# EAGLE design PrimalLogger_Feather (EAGLE 9.5.2)
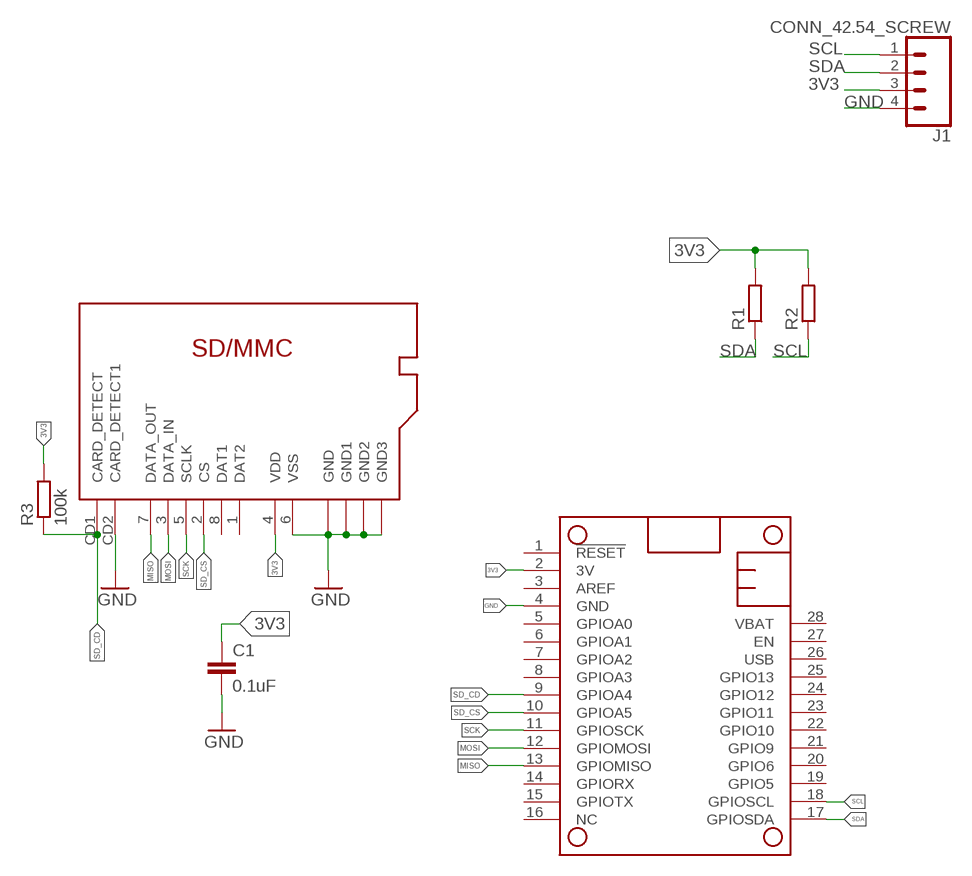
[diagram p0: schematic, sheet 1]

## Parts
C1  0.1uF  C-EU0.1UFC0603  [C0603]
J1  CONN_42.54_SCREW  [1X04_SCREW]
MS1  FEATHERWING_NODIM  [FEATHERWING_DIM]
R1  R-EU_10KR0603  [R0603]
R2  R-EU_10KR0603  [R0603]
R3  100k  R-EU_100KR0603  [R0603]
SD1  MICRO_SD  [CUSTOM-PARTS_SD_MICRO]

## Nets
3V3: C1.1 J1.3 MS1.2(3V) R1.2 R2.2 R3.2 SD1.4(VDD)
GND: C1.2 J1.4 MS1.4(GND) SD1.6(VSS) SD1.CD2(CARD_DETECT1) SD1.GND@1(GND) SD1.GND@2(GND1) SD1.GND@3(GND2) SD1.GND@5(GND3)
MISO: MS1.13(GPIOMISO) SD1.7(DATA_OUT)
MOSI: MS1.12(GPIOMOSI) SD1.3(DATA_IN)
SCK: MS1.11(GPIOSCK) SD1.5(SCLK)
SCL: J1.1 MS1.18(GPIOSCL) R2.1
SD_CD: MS1.9(GPIOA4) R3.1 SD1.CD1(CARD_DETECT)
SD_CS: MS1.10(GPIOA5) SD1.2(CS)
SDA: J1.2 MS1.17(GPIOSDA) R1.1
Unconnected: MS1.1(!RESET) MS1.3(AREF) MS1.5(GPIOA0) MS1.6(GPIOA1) MS1.7(GPIOA2) MS1.8(GPIOA3) MS1.14(GPIORX) MS1.15(GPIOTX) MS1.16(NC) MS1.19(GPIO5) MS1.20(GPIO6) MS1.21(GPIO9) MS1.22(GPIO10) MS1.23(GPIO11) MS1.24(GPIO12) MS1.25(GPIO13) MS1.26(USB) MS1.27(EN) MS1.28(VBAT) SD1.1(DAT2) SD1.8(DAT1)

## Library data of the parts
C1 = bschulz_passives:C-EU: CAPACITOR, European symbol; DIGIKEY: 490-6051-1-ND; MF: Murata; MPN: GCM188R71E104KA57D
J1 = bschulz:CONN_4: Genaric 4 terminal header Digikey 2.54_SCREW <https://www.digikey.com/product-detail/en/on-shore-technology-inc/OSTVN04A150/ED10563-ND/1588864>; DIGIKEY: ED10563-ND; MF: On Shore; MPN: OSTVN04A150
MS1 = bschulz:FEATHERWING
R1 R2 = bschulz_passives:R-EU_: RESISTOR, European symbol Digikey Parts: Yageo, 0402 <https://www.digikey.com/products/en/resistors/chip-resistor-surface-mount/52?k=&pkeyword=&sv=0&s=4356&sf=1&FV=-1%7C13%2C7%7C2%2C1291%7C39157%2C1989%7C0%2C-8%7C52%2C3%7C1131%2C3%7C2503&quantity=&ColumnSort=0&page=1&stock=1&pageSize=25> Yageo, 0603 <https://www.digikey.com/products/en/resistors/chip-resistor-surface-mount/52?k=&pkeyword=&sv=0&pv1291=39245&sf=1&FV=-5%7C4356%2C-5%7C47360%2C-8%7C52%2C-1%7C13%2C7%7C2%2C1989%7C0&quantity=10&ColumnSort=1000011&page=1&stock=1&pageSize=25> Panasonic, 0603 <https://www.digikey.com/products/en/resistors/chip-resistor-surface-mount/52?k=&pkeyword=&pv252=68&sf=0&FV=ffec373d%2C1c0002%2C142c040c%2C1f140000%2Cffe00034%2C80002%2Cc0001&quantity=&ColumnSort=0&page=1&stock=1&pageSize=25> Panasonic, precision, 0603 <https://www.digikey.com/products/en/resistors/chip-resistor-surface-mount/52?FV=ffec4907%2Cfffc000a%2Cc0172%2C142c040c%2C1f140000%2Cffe00034%2C1c0002&quantity=100&ColumnSort=2085&page=1&stock=1&pageSize=25> Panasonic, 0805 <https://www.digikey.com/products/en/resistors/chip-resistor-surface-mount/52?k=&pkeyword=&pv3=1&sf=0&FV=ffec373d%2C1c0002%2C1f140000%2Cffe00034%2C142c040d&quantity=&ColumnSort=0&page=1&stock=1&pageSize=25> Rohm, current sense <https://www.digikey.com/products/en/resistors/chip-resistor-surface-mount/52?k=&pkeyword=&pv3=1&sf=0&FV=ffecb688%2C1f140000%2Cffe00034%2C1c0002&quantity=&ColumnSort=0&page=1&stock=1&pageSize=25> Vishay, pulse proof automotive <https://www.digikey.com/products/en/resistors/chip-resistor-surface-mount/52?k=&pkeyword=&pv7=2&sf=0&FV=ffec5d6b%2Cffe00034%2C1f140000&quantity=&ColumnSort=0&page=1&stock=1&pageSize=25>; DIGIKEY: 311-10.0KHRCT-ND; MF: Yageo; MPN: RC0603FR-0710KL; VALUE_PART: 10k
R3 = bschulz_passives:R-EU_: RESISTOR, European symbol Digikey Parts: Yageo, 0402 <https://www.digikey.com/products/en/resistors/chip-resistor-surface-mount/52?k=&pkeyword=&sv=0&s=4356&sf=1&FV=-1%7C13%2C7%7C2%2C1291%7C39157%2C1989%7C0%2C-8%7C52%2C3%7C1131%2C3%7C2503&quantity=&ColumnSort=0&page=1&stock=1&pageSize=25> Yageo, 0603 <https://www.digikey.com/products/en/resistors/chip-resistor-surface-mount/52?k=&pkeyword=&sv=0&pv1291=39245&sf=1&FV=-5%7C4356%2C-5%7C47360%2C-8%7C52%2C-1%7C13%2C7%7C2%2C1989%7C0&quantity=10&ColumnSort=1000011&page=1&stock=1&pageSize=25> Panasonic, 0603 <https://www.digikey.com/products/en/resistors/chip-resistor-surface-mount/52?k=&pkeyword=&pv252=68&sf=0&FV=ffec373d%2C1c0002%2C142c040c%2C1f140000%2Cffe00034%2C80002%2Cc0001&quantity=&ColumnSort=0&page=1&stock=1&pageSize=25> Panasonic, precision, 0603 <https://www.digikey.com/products/en/resistors/chip-resistor-surface-mount/52?FV=ffec4907%2Cfffc000a%2Cc0172%2C142c040c%2C1f140000%2Cffe00034%2C1c0002&quantity=100&ColumnSort=2085&page=1&stock=1&pageSize=25> Panasonic, 0805 <https://www.digikey.com/products/en/resistors/chip-resistor-surface-mount/52?k=&pkeyword=&pv3=1&sf=0&FV=ffec373d%2C1c0002%2C1f140000%2Cffe00034%2C142c040d&quantity=&ColumnSort=0&page=1&stock=1&pageSize=25> Rohm, current sense <https://www.digikey.com/products/en/resistors/chip-resistor-surface-mount/52?k=&pkeyword=&pv3=1&sf=0&FV=ffecb688%2C1f140000%2Cffe00034%2C1c0002&quantity=&ColumnSort=0&page=1&stock=1&pageSize=25> Vishay, pulse proof automotive <https://www.digikey.com/products/en/resistors/chip-resistor-surface-mount/52?k=&pkeyword=&pv7=2&sf=0&FV=ffec5d6b%2Cffe00034%2C1f140000&quantity=&ColumnSort=0&page=1&stock=1&pageSize=25>; DIGIKEY: 311-100KHRCT-ND; MF: Yageo; MPN: RC0603FR-07100KL; VALUE_PART: 100k
SD1 = bschulz:MICRO_SD: Micro SD card holder, Push-Pull, Exposed leads for easy (non-reflow) soldering PN: HR1941CT-ND

## Board
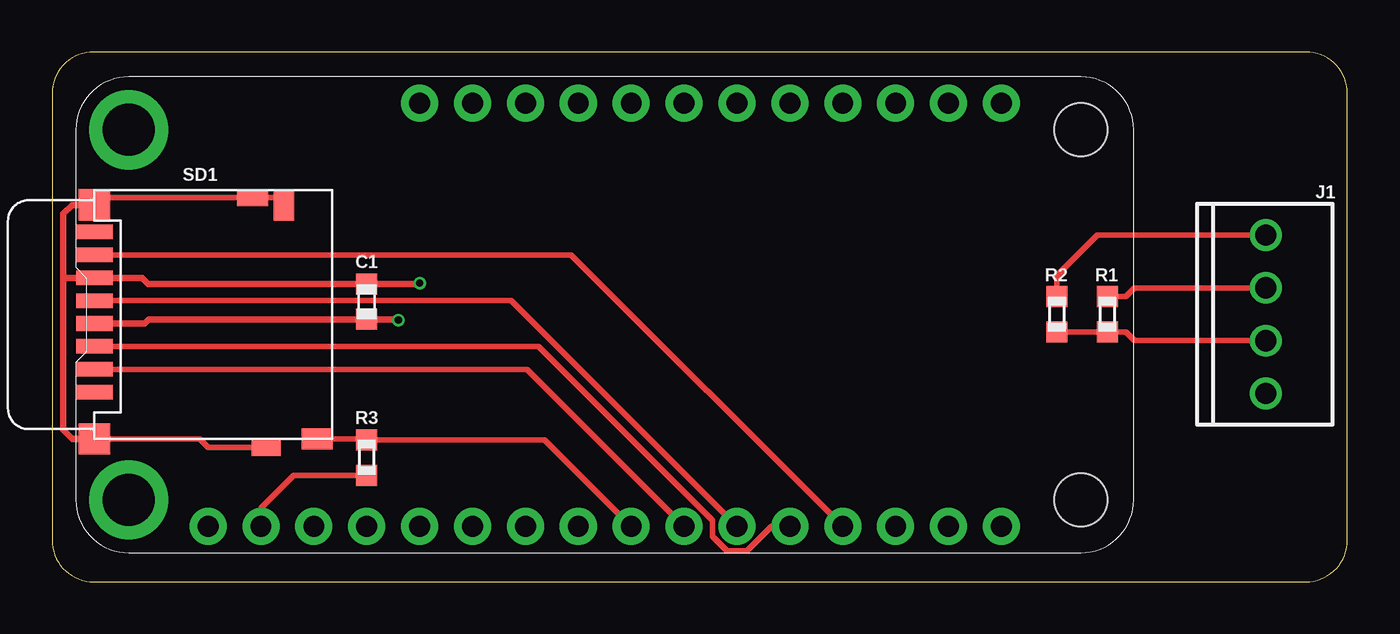
[diagram p1: board, top side]
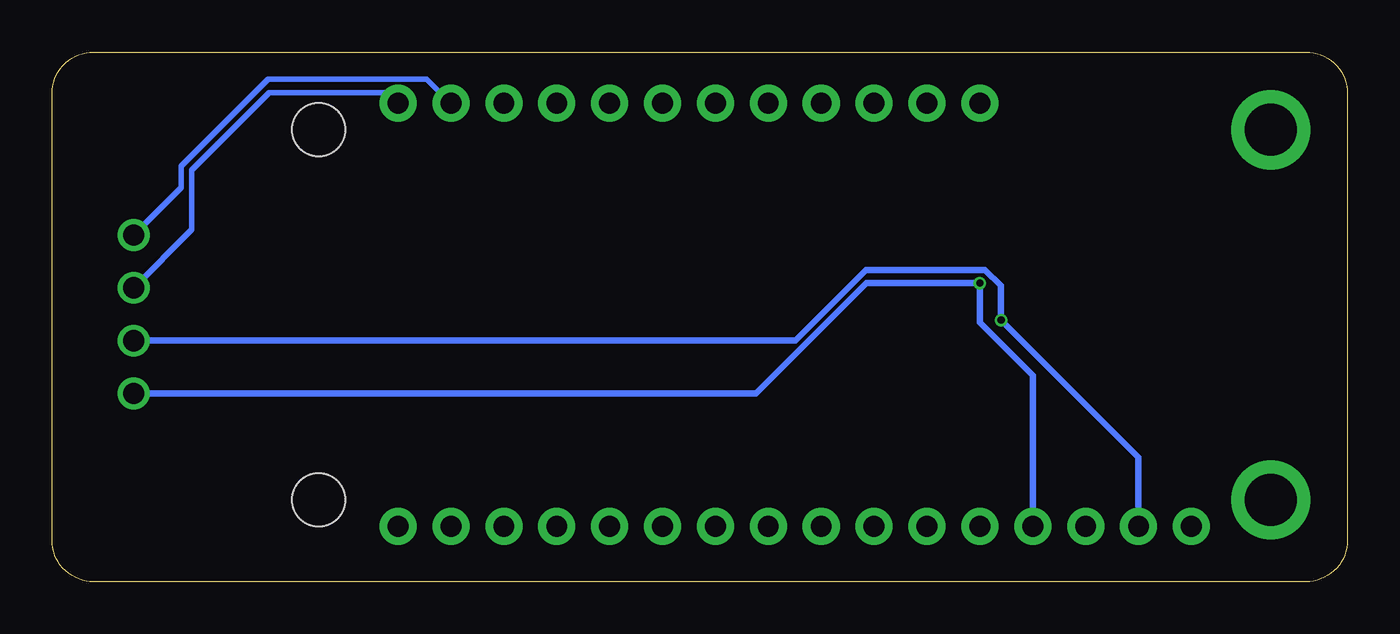
[diagram p2: board, bottom side, seen from below]

Size 62.21 x 25.45 mm. Coordinates in mm from the lower left corner, seen from the top.
Outline: 0,23.45 0,2 arc90 2,0 60.21,0 arc90 62.21,2 62.21,23.45 arc90 60.21,25.45 2,25.45 arc90 0,23.45
Copper layers (1*16): Top 0.035559375mm / dielectric 1.6mm / Bottom 0.035559375mm
Design rules "oshpark-2layer": minimum track width 6mil, minimum drill 10mil, track to track 6mil, track to pad 6mil, pad to pad 6mil, via to via 6mil, smd to smd 6mil, copper to edge 15mil, drill to drill 6mil, minimum pad ring 5mil, minimum via ring 5mil, stop-mask expansion 2.5mil, vias tented up to drill 0mil, thermal gap 10mil

### Footprints (pad centres in the part's own frame; a part is rotated, then mirrored left to right if it is on the bottom)
C0603 = smd 1 x 1: 1 -0.85,0; 2 0.85,0
1X04_SCREW = drill 1.016: 1 -3.81,0; 2 -1.27,0; 3 1.27,0; 4 3.81,0
FEATHERWING_DIM = drill 1 pad 1.778: 1 6.35,1.27; 2 8.89,1.27; 3 11.43,1.27; 4 13.97,1.27; 5 16.51,1.27; 6 19.05,1.27; 7 21.59,1.27; 8 24.13,1.27; 9 26.67,1.27; 10 29.21,1.27; 11 31.75,1.27; 12 34.29,1.27; 13 36.83,1.27; 14 39.37,1.27; 15 41.91,1.27; 16 44.45,1.27; 17 44.45,21.59; 18 41.91,21.59; 19 39.37,21.59; 20 36.83,21.59; 21 34.29,21.59; 22 31.75,21.59; 23 29.21,21.59; 24 26.67,21.59; 25 24.13,21.59; 26 21.59,21.59; 27 19.05,21.59; 28 16.51,21.59 | drill 2.5 pad 3.81: P$1 2.54,20.32; P$2 2.54,2.54 | hole 2.54: 48.26,20.32; 48.26,2.54
R0603 = smd 1 x 1: 1 -0.85,0; 2 0.85,0
CUSTOM-PARTS_SD_MICRO = smd 0.7 x 1.75: 1 -2.25,0; 2 -3.35,0; 3 -4.45,0; 4 -5.55,0; 5 -6.65,0; 6 -7.75,0; 7 -8.85,0; 8 -9.95,0 | smd 1 x 1.5: CD1 0,10.7 | smd 1.5 x 1: CD2 -11.25,9.1 | smd 1.5 x 1.5: GND@1 0,0; GND@2 -11.25,0 | smd 0.8 x 1.5: GND@3 -11.6,7.6 | smd 0.8 x 1.4: GND@5 0.4,8.25

### Placement (x,y rotation side)
C1  15.11,13.46 90 top
J1  58.29,12.85 270 top
MS1  1.14,1.4 0 top
R1  50.67,12.85 270 top
R2  48.26,12.85 270 top
R3  15.11,5.97 270 top
SD1  2.03,6.86 270 top

### Tracks (layer width: path | path; a pad name or v marks a point on that pad's centre or on a via)
3V3  (via drill 0.35)
  Top 0.254: R3.2 11.6,5.12 10.03,3.56 MS1.2 | J1.3 51.98,11.58 51.56,12 R1.2 R2.2
  Top 0.305: SD1.4 4.45,12.41 4.65,12.61 C1.1 16.6,12.61 v16.64,12.57
  Bottom 0.305: MS1.2 10.03,5.97 v16.64,12.57 16.64,14.22 17.4,14.99 23.11,14.99 26.52,11.58 J1.3
GND  (via drill 0.35)
  Top 0.254: SD1.GND@1 7.09,6.86 7.49,6.46 SD1.GND@5 | SD1.GND@2 2.38,18.46 SD1.GND@3 10.78,18.46 SD1.CD2
  Top 0.305: SD1.GND@1 0.97,6.86 0.53,7.3 0.53,14.61 | SD1.GND@2 0.96,18.11 0.53,17.68 0.53,14.61 | SD1.6 | SD1.6 0.53,14.61 | SD1.6 4.32,14.61 4.61,14.31 C1.2 17.61,14.31 v17.65,14.35
  Bottom 0.305: MS1.4 15.11,9.91 17.65,12.45 v17.65,14.35 23.1,14.35 28.41,9.04 J1.4
MISO
  Top 0.254: MS1.13 24.93,15.71 SD1.7
MOSI
  Top 0.254: MS1.12 34.55,2.67 33.38,1.5 32.41,1.5 31.73,2.18 31.73,2.95 23.36,11.31 SD1.3
SCK
  Top 0.254: MS1.11 22.05,13.51 SD1.5
SCL
  Top 0.254: R2.1 48.26,14.72 50.2,16.66 J1.1
  Bottom 0.254: MS1.18 44.22,24.16 51.83,24.16 56.01,19.98 56.01,18.95 J1.1
SD_CD
  Top 0.254: SD1.CD1 15.07,6.86 R3.1 23.66,6.82 MS1.9
SD_CS
  Top 0.254: MS1.10 22.81,10.21 SD1.2
SDA
  Top 0.254: R1.1 51.56,13.7 51.98,14.12 J1.2
  Bottom 0.254: MS1.17 46.1,23.5 51.79,23.5 55.5,19.79 55.5,16.92 J1.2

### Text on the board
tDocu: Primal / Log / Feather | SCL | SDA | 3v3 | GND | Bobby / Schulz / v0.0